# Altium schematic sheet 0056_DISPLAY - EDP MUX .SchDoc (part 2 of 2)
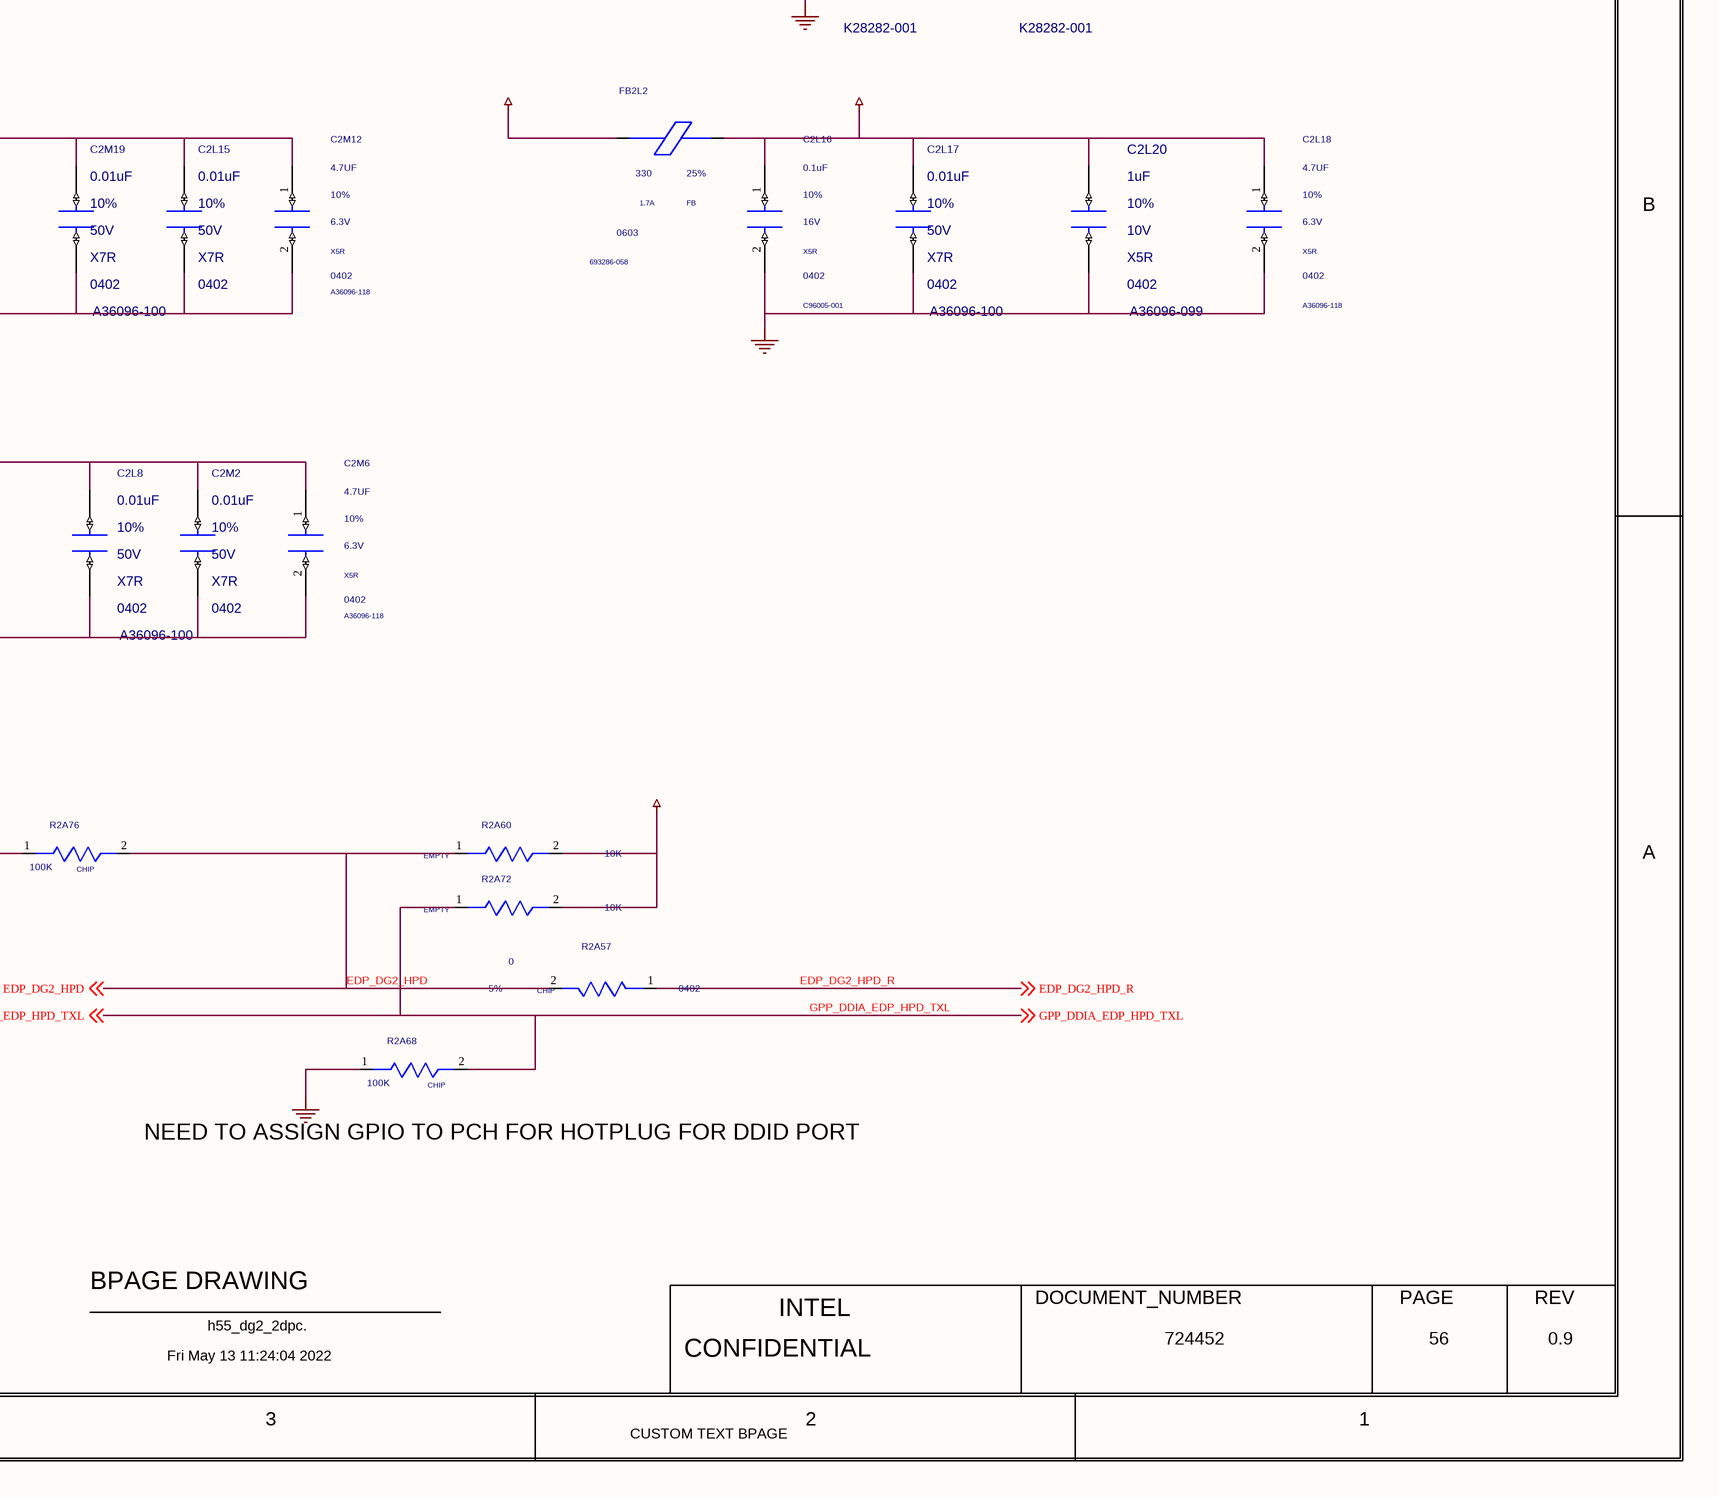
[diagram p6: 0056_DISPLAY - EDP MUX .SchDoc, bottom right]

## Library data of the parts
C2L7 = C_CAP: CDS_PHYS_PART_NAME: C_CAP_0402-K28282-001,X7R,0.1UF,16V,10%,TK2,GENERIC; CDS_LMAN_SYM_OUTLINE: -50,50,50,-50; FP_TECH: TK2; IP: GENERIC; ROOM: NONE; OriginalSymbolOrigin: (-50,25); XY: (-8450,3600); VER: 1; ROT: 0; PHYS_PAGE: 56; LOCATION: C2L7; DRAWING: @RVP1_ADL_SB_ADP_S_DDR5_SODIMM_2DPC_LIB.H55_DG2_2DPC(SCH_1):PAGE56; CDS_LIB: c_discrete; VARIANT: ?; PCB Footprint: CTK2_SM0402_1050X550_MA; CHIPS_PART_NAME: C_CAP; CDS_PART_NAME: C_CAP_0402-K28282-001,X7R,0.1UF,16V,10%,TK2,GENERIC; CDS_LOCATION: C2L7
C2L8 = C_CAP: CDS_PHYS_PART_NAME: C_CAP_0402-A36096-100,X7R,0.01UF,50V,10%,TK2,GENERIC; CDS_LMAN_SYM_OUTLINE: -50,50,50,-50; FP_TECH: TK2; IP: GENERIC; ROOM: NONE; OriginalSymbolOrigin: (-50,25); XY: (-7725,3600); VER: 1; ROT: 0; PHYS_PAGE: 56; LOCATION: C2L8; DRAWING: @RVP1_ADL_SB_ADP_S_DDR5_SODIMM_2DPC_LIB.H55_DG2_2DPC(SCH_1):PAGE56; CDS_LIB: c_discrete; VARIANT: ?; PCB Footprint: CTK2_SM0402_1050X550_MA; CHIPS_PART_NAME: C_CAP; CDS_PART_NAME: C_CAP_0402-A36096-100,X7R,0.01UF,50V,10%,TK2,GENERIC; CDS_LOCATION: C2L8
C2L9 = C_CAP: CDS_PHYS_PART_NAME: C_CAP_0402-K28282-001,X7R,0.1UF,16V,10%,TK2,GENERIC; CDS_LMAN_SYM_OUTLINE: -50,50,50,-50; FP_TECH: TK2; IP: GENERIC; ROOM: NONE; OriginalSymbolOrigin: (-50,25); XY: (-6400,4775); VER: 1; ROT: 0; PHYS_PAGE: 56; LOCATION: C2L9; DRAWING: @RVP1_ADL_SB_ADP_S_DDR5_SODIMM_2DPC_LIB.H55_DG2_2DPC(SCH_1):PAGE56; CDS_LIB: c_discrete; VARIANT: ?; PCB Footprint: CTK2_SM0402_1050X550_MA; CHIPS_PART_NAME: C_CAP; CDS_PART_NAME: C_CAP_0402-K28282-001,X7R,0.1UF,16V,10%,TK2,GENERIC; CDS_LOCATION: C2L9
C2L10 = C_CAP: CDS_PHYS_PART_NAME: C_CAP_0402-A36096-100,X7R,0.01UF,50V,10%,TK2,GENERIC; CDS_LMAN_SYM_OUTLINE: -50,50,50,-50; FP_TECH: TK2; IP: GENERIC; ROOM: NONE; OriginalSymbolOrigin: (-50,25); XY: (-7750,4800); VER: 1; ROT: 0; PHYS_PAGE: 56; LOCATION: C2L10; DRAWING: @RVP1_ADL_SB_ADP_S_DDR5_SODIMM_2DPC_LIB.H55_DG2_2DPC(SCH_1):PAGE56; CDS_LIB: c_discrete; VARIANT: ?; PCB Footprint: CTK2_SM0402_1050X550_MA; CHIPS_PART_NAME: C_CAP; CDS_PART_NAME: C_CAP_0402-A36096-100,X7R,0.01UF,50V,10%,TK2,GENERIC; CDS_LOCATION: C2L10
C2L11 = C_CAP: PART_NUMBER: K28282-001; CDS_PHYS_PART_NAME: C_CAP_0402-K28282-001,X7R,0.1UF,16V,10%,TK2,GENERIC; CDS_LMAN_SYM_OUTLINE: -50,50,50,-50; FP_TECH: TK2; IP: GENERIC; ROOM: NONE; OriginalSymbolOrigin: (-50,25); XY: (-8175,4800); VER: 1; ROT: 0; PHYS_PAGE: 56; LOCATION: C2L11; DRAWING: @RVP1_ADL_SB_ADP_S_DDR5_SODIMM_2DPC_LIB.H55_DG2_2DPC(SCH_1):PAGE56; CDS_LIB: c_discrete; VARIANT: ?; PCB Footprint: CTK2_SM0402_1050X550_MA; CHIPS_PART_NAME: C_CAP; CDS_PART_NAME: C_CAP_0402-K28282-001,X7R,0.1UF,16V,10%,TK2,GENERIC; CDS_LOCATION: C2L11
C2L12 = C_CAP: CDS_PHYS_PART_NAME: C_CAP_0402-A36096-100,X7R,0.01UF,50V,10%,TK2,GENERIC; CDS_LMAN_SYM_OUTLINE: -50,50,50,-50; FP_TECH: TK2; IP: GENERIC; ROOM: NONE; OriginalSymbolOrigin: (-50,25); XY: (-5750,4800); VER: 1; ROT: 0; PHYS_PAGE: 56; LOCATION: C2L12; DRAWING: @RVP1_ADL_SB_ADP_S_DDR5_SODIMM_2DPC_LIB.H55_DG2_2DPC(SCH_1):PAGE56; CDS_LIB: c_discrete; VARIANT: ?; PCB Footprint: CTK2_SM0402_1050X550_MA; CHIPS_PART_NAME: C_CAP; CDS_PART_NAME: C_CAP_0402-A36096-100,X7R,0.01UF,50V,10%,TK2,GENERIC; CDS_LOCATION: C2L12
C2L13 = CAP: CDS_PHYS_PART_NAME: CAP_0402-A36096-143,X5R,1UF,25V,10%,LPDB,GENERIC; OriginalSymbolOrigin: (-50,25); XY: (-6000,5400); VER: 1; ROT: 0; PHYS_PAGE: 56; LOCATION: C2L13; IP: GENERIC; FP_TECH: LPDB; DRAWING: @RVP1_ADL_SB_ADP_S_DDR5_SODIMM_2DPC_LIB.H55_DG2_2DPC(SCH_1):PAGE56; CDS_LIB: discrete; PCB Footprint: SMC0402MA; CHIPS_PART_NAME: CAP; CDS_PART_NAME: CAP_0402-A36096-143,X5R,1UF,25V,10%,LPDB,GENERIC; CDS_LOCATION: C2L13
C2L14 = C_CAP: CDS_PHYS_PART_NAME: C_CAP_0402-K28282-001,X7R,0.1UF,16V,10%,TK2,GENERIC; CDS_LMAN_SYM_OUTLINE: -50,50,50,-50; FP_TECH: TK2; IP: GENERIC; ROOM: NONE; OriginalSymbolOrigin: (-50,25); XY: (-8475,4200); VER: 1; ROT: 0; PHYS_PAGE: 56; LOCATION: C2L14; DRAWING: @RVP1_ADL_SB_ADP_S_DDR5_SODIMM_2DPC_LIB.H55_DG2_2DPC(SCH_1):PAGE56; CDS_LIB: c_discrete; VARIANT: ?; PCB Footprint: CTK2_SM0402_1050X550_MA; CHIPS_PART_NAME: C_CAP; CDS_PART_NAME: C_CAP_0402-K28282-001,X7R,0.1UF,16V,10%,TK2,GENERIC; CDS_LOCATION: C2L14
C2L15 = C_CAP: PART_NUMBER: A36096-100; CDS_PHYS_PART_NAME: C_CAP_0402-A36096-100,X7R,0.01UF,50V,10%,TK2,GENERIC; CDS_LMAN_SYM_OUTLINE: -50,50,50,-50; FP_TECH: TK2; IP: GENERIC; ROOM: NONE; OriginalSymbolOrigin: (-50,25); XY: (-7550,4200); VER: 1; ROT: 0; PHYS_PAGE: 56; LOCATION: C2L15; DRAWING: @RVP1_ADL_SB_ADP_S_DDR5_SODIMM_2DPC_LIB.H55_DG2_2DPC(SCH_1):PAGE56; CDS_LIB: c_discrete; VARIANT: ?; PCB Footprint: CTK2_SM0402_1050X550_MA; CHIPS_PART_NAME: C_CAP; CDS_PART_NAME: C_CAP_0402-A36096-100,X7R,0.01UF,50V,10%,TK2,GENERIC; CDS_LOCATION: C2L15
C2L16 = CAP: CDS_PHYS_PART_NAME: CAP_0402-C96005-001,X5R,0.1UF,16V,10%,LPDB,GENERIC; OriginalSymbolOrigin: (-50,25); XY: (-6475,4200); VER: 1; ROT: 0; PHYS_PAGE: 56; LOCATION: C2L16; IP: GENERIC; FP_TECH: LPDB; DRAWING: @RVP1_ADL_SB_ADP_S_DDR5_SODIMM_2DPC_LIB.H55_DG2_2DPC(SCH_1):PAGE56; CDS_LIB: discrete; PCB Footprint: SMC0402IE; CHIPS_PART_NAME: CAP; CDS_PART_NAME: CAP_0402-C96005-001,X5R,0.1UF,16V,10%,LPDB,GENERIC; CDS_LOCATION: C2L16
C2L17 = C_CAP: CDS_PHYS_PART_NAME: C_CAP_0402-A36096-100,X7R,0.01UF,50V,10%,TK2,GENERIC; CDS_LMAN_SYM_OUTLINE: -50,50,50,-50; FP_TECH: TK2; IP: GENERIC; ROOM: NONE; OriginalSymbolOrigin: (-50,25); XY: (-6200,4200); VER: 1; ROT: 0; PHYS_PAGE: 56; LOCATION: C2L17; DRAWING: @RVP1_ADL_SB_ADP_S_DDR5_SODIMM_2DPC_LIB.H55_DG2_2DPC(SCH_1):PAGE56; CDS_LIB: c_discrete; VARIANT: ?; PCB Footprint: CTK2_SM0402_1050X550_MA; CHIPS_PART_NAME: C_CAP; CDS_PART_NAME: C_CAP_0402-A36096-100,X7R,0.01UF,50V,10%,TK2,GENERIC; CDS_LOCATION: C2L17
C2L18 = CAP: CDS_PHYS_PART_NAME: CAP_0402-A36096-118,X5R,4.7UF,6.3V,10%,LPDB,GENERIC; OriginalSymbolOrigin: (-50,25); XY: (-5550,4200); VER: 1; ROT: 0; PHYS_PAGE: 56; LOCATION: C2L18; IP: GENERIC; FP_TECH: LPDB; DRAWING: @RVP1_ADL_SB_ADP_S_DDR5_SODIMM_2DPC_LIB.H55_DG2_2DPC(SCH_1):PAGE56; CDS_LIB: discrete; PCB Footprint: SMC0402MA; CHIPS_PART_NAME: CAP; CDS_PART_NAME: CAP_0402-A36096-118,X5R,4.7UF,6.3V,10%,LPDB,GENERIC; CDS_LOCATION: C2L18
C2L20 = C_CAP: CDS_PHYS_PART_NAME: C_CAP_0402-A36096-099,X5R,1UF,10V,10%,TK2,GENERIC; CDS_LMAN_SYM_OUTLINE: -50,50,50,-50; FP_TECH: TK2; IP: GENERIC; ROOM: NONE; OriginalSymbolOrigin: (-50,25); XY: (-5875,4200); VER: 1; ROT: 0; PHYS_PAGE: 56; LOCATION: C2L20; DRAWING: @RVP1_ADL_SB_ADP_S_DDR5_SODIMM_2DPC_LIB.H55_DG2_2DPC(SCH_1):PAGE56; CDS_LIB: c_discrete; VARIANT: ?; PCB Footprint: CTK2_SM0402_1050X550_MA; CHIPS_PART_NAME: C_CAP; CDS_PART_NAME: C_CAP_0402-A36096-099,X5R,1UF,10V,10%,TK2,GENERIC; CDS_LOCATION: C2L20
C2M1 = C_CAP: PART_NUMBER: A36096-100; CDS_PHYS_PART_NAME: C_CAP_0402-A36096-100,X7R,0.01UF,50V,10%,TK2,GENERIC; CDS_LMAN_SYM_OUTLINE: -50,50,50,-50; FP_TECH: TK2; IP: GENERIC; ROOM: NONE; OriginalSymbolOrigin: (-50,25); XY: (-5550,4800); VER: 1; ROT: 0; PHYS_PAGE: 56; LOCATION: C2M1; DRAWING: @RVP1_ADL_SB_ADP_S_DDR5_SODIMM_2DPC_LIB.H55_DG2_2DPC(SCH_1):PAGE56; CDS_LIB: c_discrete; VARIANT: ?; PCB Footprint: CTK2_SM0402_1050X550_MA; CHIPS_PART_NAME: C_CAP; CDS_PART_NAME: C_CAP_0402-A36096-100,X7R,0.01UF,50V,10%,TK2,GENERIC; CDS_LOCATION: C2M1
C2M2 = C_CAP: PART_NUMBER: A36096-100; CDS_PHYS_PART_NAME: C_CAP_0402-A36096-100,X7R,0.01UF,50V,10%,TK2,GENERIC; CDS_LMAN_SYM_OUTLINE: -50,50,50,-50; FP_TECH: TK2; IP: GENERIC; ROOM: NONE; OriginalSymbolOrigin: (-50,25); XY: (-7525,3600); VER: 1; ROT: 0; PHYS_PAGE: 56; LOCATION: C2M2; DRAWING: @RVP1_ADL_SB_ADP_S_DDR5_SODIMM_2DPC_LIB.H55_DG2_2DPC(SCH_1):PAGE56; CDS_LIB: c_discrete; VARIANT: ?; PCB Footprint: CTK2_SM0402_1050X550_MA; CHIPS_PART_NAME: C_CAP; CDS_PART_NAME: C_CAP_0402-A36096-100,X7R,0.01UF,50V,10%,TK2,GENERIC; CDS_LOCATION: C2M2
C2M4 = C_CAP: CDS_PHYS_PART_NAME: C_CAP_0402-K28282-001,X7R,0.1UF,16V,10%,TK2,GENERIC; CDS_LMAN_SYM_OUTLINE: -50,50,50,-50; FP_TECH: TK2; IP: GENERIC; ROOM: NONE; OriginalSymbolOrigin: (-50,25); XY: (-8475,4800); VER: 1; ROT: 0; PHYS_PAGE: 56; LOCATION: C2M4; DRAWING: @RVP1_ADL_SB_ADP_S_DDR5_SODIMM_2DPC_LIB.H55_DG2_2DPC(SCH_1):PAGE56; CDS_LIB: c_discrete; VARIANT: ?; PCB Footprint: CTK2_SM0402_1050X550_MA; CHIPS_PART_NAME: C_CAP; CDS_PART_NAME: C_CAP_0402-K28282-001,X7R,0.1UF,16V,10%,TK2,GENERIC; CDS_LOCATION: C2M4
C2M5 = CAP: CDS_PHYS_PART_NAME: CAP_0402-A36096-118,X5R,4.7UF,6.3V,10%,LPDB,GENERIC; OriginalSymbolOrigin: (-50,25); XY: (-5350,4800); VER: 1; ROT: 0; PHYS_PAGE: 56; LOCATION: C2M5; IP: GENERIC; FP_TECH: LPDB; DRAWING: @RVP1_ADL_SB_ADP_S_DDR5_SODIMM_2DPC_LIB.H55_DG2_2DPC(SCH_1):PAGE56; CDS_LIB: discrete; PCB Footprint: SMC0402MA; CHIPS_PART_NAME: CAP; CDS_PART_NAME: CAP_0402-A36096-118,X5R,4.7UF,6.3V,10%,LPDB,GENERIC; CDS_LOCATION: C2M5
C2M6 = CAP: CDS_PHYS_PART_NAME: CAP_0402-A36096-118,X5R,4.7UF,6.3V,10%,LPDB,GENERIC; OriginalSymbolOrigin: (-50,25); XY: (-7325,3600); VER: 1; ROT: 0; PHYS_PAGE: 56; LOCATION: C2M6; IP: GENERIC; FP_TECH: LPDB; DRAWING: @RVP1_ADL_SB_ADP_S_DDR5_SODIMM_2DPC_LIB.H55_DG2_2DPC(SCH_1):PAGE56; CDS_LIB: discrete; PCB Footprint: SMC0402MA; CHIPS_PART_NAME: CAP; CDS_PART_NAME: CAP_0402-A36096-118,X5R,4.7UF,6.3V,10%,LPDB,GENERIC; CDS_LOCATION: C2M6
C2M7 = C_CAP: CDS_PHYS_PART_NAME: C_CAP_0402-K28282-001,X7R,0.1UF,16V,10%,TK2,GENERIC; CDS_LMAN_SYM_OUTLINE: -50,50,50,-50; FP_TECH: TK2; IP: GENERIC; ROOM: NONE; OriginalSymbolOrigin: (-50,25); XY: (-6075,4775); VER: 1; ROT: 0; PHYS_PAGE: 56; LOCATION: C2M7; DRAWING: @RVP1_ADL_SB_ADP_S_DDR5_SODIMM_2DPC_LIB.H55_DG2_2DPC(SCH_1):PAGE56; CDS_LIB: c_discrete; VARIANT: ?; PCB Footprint: CTK2_SM0402_1050X550_MA; CHIPS_PART_NAME: C_CAP; CDS_PART_NAME: C_CAP_0402-K28282-001,X7R,0.1UF,16V,10%,TK2,GENERIC; CDS_LOCATION: C2M7
C2M8 = C_CAP: PART_NUMBER: A36096-100; CDS_PHYS_PART_NAME: C_CAP_0402-A36096-100,X7R,0.01UF,50V,10%,TK2,GENERIC; CDS_LMAN_SYM_OUTLINE: -50,50,50,-50; FP_TECH: TK2; IP: GENERIC; ROOM: NONE; OriginalSymbolOrigin: (-50,25); XY: (-7550,4800); VER: 1; ROT: 0; PHYS_PAGE: 56; LOCATION: C2M8; DRAWING: @RVP1_ADL_SB_ADP_S_DDR5_SODIMM_2DPC_LIB.H55_DG2_2DPC(SCH_1):PAGE56; CDS_LIB: c_discrete; VARIANT: ?; PCB Footprint: CTK2_SM0402_1050X550_MA; CHIPS_PART_NAME: C_CAP; CDS_PART_NAME: C_CAP_0402-A36096-100,X7R,0.01UF,50V,10%,TK2,GENERIC; CDS_LOCATION: C2M8
C2M11 = C_CAP: CDS_PHYS_PART_NAME: C_CAP_0402-K28282-001,X7R,0.1UF,16V,10%,TK2,GENERIC; CDS_LMAN_SYM_OUTLINE: -50,50,50,-50; FP_TECH: TK2; IP: GENERIC; ROOM: NONE; OriginalSymbolOrigin: (-50,25); XY: (-8125,3600); VER: 1; ROT: 0; PHYS_PAGE: 56; LOCATION: C2M11; DRAWING: @RVP1_ADL_SB_ADP_S_DDR5_SODIMM_2DPC_LIB.H55_DG2_2DPC(SCH_1):PAGE56; CDS_LIB: c_discrete; VARIANT: ?; PCB Footprint: CTK2_SM0402_1050X550_MA; CHIPS_PART_NAME: C_CAP; CDS_PART_NAME: C_CAP_0402-K28282-001,X7R,0.1UF,16V,10%,TK2,GENERIC; CDS_LOCATION: C2M11
C2M12 = CAP: CDS_PHYS_PART_NAME: CAP_0402-A36096-118,X5R,4.7UF,6.3V,10%,LPDB,GENERIC; OriginalSymbolOrigin: (-50,25); XY: (-7350,4200); VER: 1; ROT: 0; PHYS_PAGE: 56; LOCATION: C2M12; IP: GENERIC; FP_TECH: LPDB; DRAWING: @RVP1_ADL_SB_ADP_S_DDR5_SODIMM_2DPC_LIB.H55_DG2_2DPC(SCH_1):PAGE56; CDS_LIB: discrete; PCB Footprint: SMC0402MA; CHIPS_PART_NAME: CAP; CDS_PART_NAME: CAP_0402-A36096-118,X5R,4.7UF,6.3V,10%,LPDB,GENERIC; CDS_LOCATION: C2M12
C2M13 = CAP: CDS_PHYS_PART_NAME: CAP_0402-A36096-118,X5R,4.7UF,6.3V,10%,LPDB,GENERIC; OriginalSymbolOrigin: (-50,25); XY: (-7350,4800); VER: 1; ROT: 0; PHYS_PAGE: 56; LOCATION: C2M13; IP: GENERIC; FP_TECH: LPDB; DRAWING: @RVP1_ADL_SB_ADP_S_DDR5_SODIMM_2DPC_LIB.H55_DG2_2DPC(SCH_1):PAGE56; CDS_LIB: discrete; PCB Footprint: SMC0402MA; CHIPS_PART_NAME: CAP; CDS_PART_NAME: CAP_0402-A36096-118,X5R,4.7UF,6.3V,10%,LPDB,GENERIC; CDS_LOCATION: C2M13
C2M19 = C_CAP: CDS_PHYS_PART_NAME: C_CAP_0402-A36096-100,X7R,0.01UF,50V,10%,TK2,GENERIC; CDS_LMAN_SYM_OUTLINE: -50,50,50,-50; FP_TECH: TK2; IP: GENERIC; ROOM: NONE; OriginalSymbolOrigin: (-50,25); XY: (-7750,4200); VER: 1; ROT: 0; PHYS_PAGE: 56; LOCATION: C2M19; DRAWING: @RVP1_ADL_SB_ADP_S_DDR5_SODIMM_2DPC_LIB.H55_DG2_2DPC(SCH_1):PAGE56; CDS_LIB: c_discrete; VARIANT: ?; PCB Footprint: CTK2_SM0402_1050X550_MA; CHIPS_PART_NAME: C_CAP; CDS_PART_NAME: C_CAP_0402-A36096-100,X7R,0.01UF,50V,10%,TK2,GENERIC; CDS_LOCATION: C2M19
C2M20 = C_CAP: PART_NUMBER: K28282-001; CDS_PHYS_PART_NAME: C_CAP_0402-K28282-001,X7R,0.1UF,16V,10%,TK2,GENERIC; CDS_LMAN_SYM_OUTLINE: -50,50,50,-50; FP_TECH: TK2; IP: GENERIC; ROOM: NONE; OriginalSymbolOrigin: (-50,25); XY: (-8150,4200); VER: 1; ROT: 0; PHYS_PAGE: 56; LOCATION: C2M20; DRAWING: @RVP1_ADL_SB_ADP_S_DDR5_SODIMM_2DPC_LIB.H55_DG2_2DPC(SCH_1):PAGE56; CDS_LIB: c_discrete; VARIANT: ?; PCB Footprint: CTK2_SM0402_1050X550_MA; CHIPS_PART_NAME: C_CAP; CDS_PART_NAME: C_CAP_0402-K28282-001,X7R,0.1UF,16V,10%,TK2,GENERIC; CDS_LOCATION: C2M20
EU5601 = C_PS8461E_A: CDS_PHYS_PART_NAME: C_PS8461E_A_LCC-M58413-001,IC,PS8461EQFN66GTR-A3,TK2,GENERIC; CDS_LMAN_SYM_OUTLINE: -400,500,400,-550; FP_TECH: TK2; IP: GENERIC; PACK_TYPE: LCC; ROOM: NONE; OriginalSymbolOrigin: (-425,500); CaptureCellPackProp: C_PS8461E_AA; XY: (-11175,3700); VER: 1; ROT: 0; PHYS_PAGE: 56; LOCATION: EU5601; DRAWING: @RVP1_ADL_SB_ADP_S_DDR5_SODIMM_2DPC_LIB.H55_DG2_2DPC(SCH_1):PAGE56; CDS_LIB: local; VARIANT: ?; PCB Footprint: CTK2_LCC66_5000X10000_400_DF3600X8600_MA; SEC_TYPE: LCC; CHIPS_PART_NAME: C_PS8461E_A; CDS_PART_NAME: C_PS8461E_A_LCC-M58413-001,IC,PS8461EQFN66GTR-A3,TK2,GENERIC; CDS_LOCATION: EU5601
FB2L1 = C_FERRITE: CDS_PHYS_PART_NAME: C_FERRITE_0603-693286-058,FB,330,25%,1.7A,TK2,GENERIC; CDS_LMAN_SYM_OUTLINE: -50,50,50,-50; FP_TECH: TK2; IP: GENERIC; ROOM: NONE; OriginalSymbolOrigin: (-75,50); XY: (-8625,3750); VER: 1; ROT: 0; PHYS_PAGE: 56; LOCATION: FB2L1; DRAWING: @RVP1_ADL_SB_ADP_S_DDR5_SODIMM_2DPC_LIB.H55_DG2_2DPC(SCH_1):PAGE56; CDS_LIB: c_discrete; VARIANT: ?; PCB Footprint: CTK2_SM0603_1750X950_MA; CHIPS_PART_NAME: C_FERRITE; CDS_PART_NAME: C_FERRITE_0603-693286-058,FB,330,25%,1.7A,TK2,GENERIC; CDS_LOCATION: FB2L1
FB2L2 = C_FERRITE: CDS_PHYS_PART_NAME: C_FERRITE_0603-693286-058,FB,330,25%,1.7A,TK2,GENERIC; CDS_LMAN_SYM_OUTLINE: -50,50,50,-50; FP_TECH: TK2; IP: GENERIC; ROOM: NONE; OriginalSymbolOrigin: (-75,50); XY: (-6650,4350); VER: 1; ROT: 0; PHYS_PAGE: 56; LOCATION: FB2L2; DRAWING: @RVP1_ADL_SB_ADP_S_DDR5_SODIMM_2DPC_LIB.H55_DG2_2DPC(SCH_1):PAGE56; CDS_LIB: c_discrete; VARIANT: ?; PCB Footprint: CTK2_SM0603_1750X950_MA; CHIPS_PART_NAME: C_FERRITE; CDS_PART_NAME: C_FERRITE_0603-693286-058,FB,330,25%,1.7A,TK2,GENERIC; CDS_LOCATION: FB2L2
FB2L3 = C_FERRITE: CDS_PHYS_PART_NAME: C_FERRITE_0603-693286-058,FB,330,25%,1.7A,TK2,GENERIC; CDS_LMAN_SYM_OUTLINE: -50,50,50,-50; FP_TECH: TK2; IP: GENERIC; ROOM: NONE; OriginalSymbolOrigin: (-75,50); XY: (-6650,4950); VER: 1; ROT: 0; PHYS_PAGE: 56; LOCATION: FB2L3; DRAWING: @RVP1_ADL_SB_ADP_S_DDR5_SODIMM_2DPC_LIB.H55_DG2_2DPC(SCH_1):PAGE56; CDS_LIB: c_discrete; VARIANT: ?; PCB Footprint: CTK2_SM0603_1750X950_MA; CHIPS_PART_NAME: C_FERRITE; CDS_PART_NAME: C_FERRITE_0603-693286-058,FB,330,25%,1.7A,TK2,GENERIC; CDS_LOCATION: FB2L3
FB2M1 = C_FERRITE: CDS_PHYS_PART_NAME: C_FERRITE_0603-693286-058,FB,330,25%,1.7A,TK2,GENERIC; CDS_LMAN_SYM_OUTLINE: -50,50,50,-50; FP_TECH: TK2; IP: GENERIC; ROOM: NONE; OriginalSymbolOrigin: (-75,50); XY: (-8650,4350); VER: 1; ROT: 0; PHYS_PAGE: 56; LOCATION: FB2M1; DRAWING: @RVP1_ADL_SB_ADP_S_DDR5_SODIMM_2DPC_LIB.H55_DG2_2DPC(SCH_1):PAGE56; CDS_LIB: c_discrete; VARIANT: ?; PCB Footprint: CTK2_SM0603_1750X950_MA; CHIPS_PART_NAME: C_FERRITE; CDS_PART_NAME: C_FERRITE_0603-693286-058,FB,330,25%,1.7A,TK2,GENERIC; CDS_LOCATION: FB2M1
FB2M2 = C_FERRITE: CDS_PHYS_PART_NAME: C_FERRITE_0603-693286-058,FB,330,25%,1.7A,TK2,GENERIC; CDS_LMAN_SYM_OUTLINE: -50,50,50,-50; FP_TECH: TK2; IP: GENERIC; ROOM: NONE; OriginalSymbolOrigin: (-75,50); XY: (-8650,4950); VER: 1; ROT: 0; PHYS_PAGE: 56; LOCATION: FB2M2; DRAWING: @RVP1_ADL_SB_ADP_S_DDR5_SODIMM_2DPC_LIB.H55_DG2_2DPC(SCH_1):PAGE56; CDS_LIB: c_discrete; VARIANT: ?; PCB Footprint: CTK2_SM0603_1750X950_MA; CHIPS_PART_NAME: C_FERRITE; CDS_PART_NAME: C_FERRITE_0603-693286-058,FB,330,25%,1.7A,TK2,GENERIC; CDS_LOCATION: FB2M2
R2A33 = RES#1: PART_NUMBER: G21497-014; CHIPS_PART_NAME: RES; CDS_PHYS_PART_NAME: RES_0402-G21497-014,EMPTY,10K,5%,1/16W,LPDB,GENERIC; TOLERANCE: 5%; WATTAGE: 1/16W; OriginalSymbolOrigin: (-75,25); XY: (-11525,5700); VER: 1; ROOM: ROOM_PROP_TEST_73; PHYS_PAGE: 56; LOCATION: R2A33; IP: GENERIC; FP_TECH: LPDB; DRAWING: @RVP1_ADL_SB_ADP_S_DDR5_SODIMM_2DPC_LIB.H55_DG2_2DPC(SCH_1):PAGE56; CDS_LIB: discrete; PCB Footprint: SMR0402IA; ROT: 1; CDS_PART_NAME: RES_0402-G21497-014,EMPTY,10K,5%,1/16W,LPDB,GENERIC; CDS_LOCATION: R2A33
R2A34 = RES#1: PART_NUMBER: G21497-014; CHIPS_PART_NAME: RES; CDS_PHYS_PART_NAME: RES_0402-G21497-014,EMPTY,10K,5%,1/16W,LPDB,GENERIC; TOLERANCE: 5%; WATTAGE: 1/16W; OriginalSymbolOrigin: (-75,25); XY: (-10525,5700); VER: 1; ROOM: ROOM_PROP_TEST_73; PHYS_PAGE: 56; LOCATION: R2A34; IP: GENERIC; FP_TECH: LPDB; DRAWING: @RVP1_ADL_SB_ADP_S_DDR5_SODIMM_2DPC_LIB.H55_DG2_2DPC(SCH_1):PAGE56; CDS_LIB: discrete; PCB Footprint: SMR0402IA; ROT: 1; CDS_PART_NAME: RES_0402-G21497-014,EMPTY,10K,5%,1/16W,LPDB,GENERIC; CDS_LOCATION: R2A34
R2A35 = RES#1: PART_NUMBER: G21497-014; CHIPS_PART_NAME: RES; CDS_PHYS_PART_NAME: RES_0402-G21497-014,EMPTY,10K,5%,1/16W,LPDB,GENERIC; TOLERANCE: 5%; WATTAGE: 1/16W; OriginalSymbolOrigin: (-75,25); XY: (-11150,5700); VER: 1; ROOM: ROOM_PROP_TEST_73; PHYS_PAGE: 56; LOCATION: R2A35; IP: GENERIC; FP_TECH: LPDB; DRAWING: @RVP1_ADL_SB_ADP_S_DDR5_SODIMM_2DPC_LIB.H55_DG2_2DPC(SCH_1):PAGE56; CDS_LIB: discrete; PCB Footprint: SMR0402IA; ROT: 1; CDS_PART_NAME: RES_0402-G21497-014,EMPTY,10K,5%,1/16W,LPDB,GENERIC; CDS_LOCATION: R2A35
R2A36 = RES#1: PART_NUMBER: A93548-517; CHIPS_PART_NAME: RES; CDS_PHYS_PART_NAME: RES_0402-A93548-517,CHIP,4.7K,1%,1/16W,LPDB,GENERIC; TOLERANCE: 1%; WATTAGE: 1/16W; OriginalSymbolOrigin: (-75,25); XY: (-11400,5700); VER: 1; ROOM: ROOM_PROP_TEST_73; PHYS_PAGE: 56; LOCATION: R2A36; IP: GENERIC; FP_TECH: LPDB; DRAWING: @RVP1_ADL_SB_ADP_S_DDR5_SODIMM_2DPC_LIB.H55_DG2_2DPC(SCH_1):PAGE56; CDS_LIB: discrete; PCB Footprint: SMR0402IA; ROT: 1; CDS_PART_NAME: RES_0402-A93548-517,CHIP,4.7K,1%,1/16W,LPDB,GENERIC; CDS_LOCATION: R2A36
R2A37 = RES#1: PART_NUMBER: G21497-014; CHIPS_PART_NAME: RES; CDS_PHYS_PART_NAME: RES_0402-G21497-014,EMPTY,10K,5%,1/16W,LPDB,GENERIC; TOLERANCE: 5%; WATTAGE: 1/16W; OriginalSymbolOrigin: (-75,25); XY: (-11275,5700); VER: 1; ROOM: ROOM_PROP_TEST_73; PHYS_PAGE: 56; LOCATION: R2A37; IP: GENERIC; FP_TECH: LPDB; DRAWING: @RVP1_ADL_SB_ADP_S_DDR5_SODIMM_2DPC_LIB.H55_DG2_2DPC(SCH_1):PAGE56; CDS_LIB: discrete; PCB Footprint: SMR0402IA; ROT: 1; CDS_PART_NAME: RES_0402-G21497-014,EMPTY,10K,5%,1/16W,LPDB,GENERIC; CDS_LOCATION: R2A37
R2A38 = RES#1: PART_NUMBER: G21497-014; CHIPS_PART_NAME: RES; CDS_PHYS_PART_NAME: RES_0402-G21497-014,EMPTY,10K,5%,1/16W,LPDB,GENERIC; TOLERANCE: 5%; WATTAGE: 1/16W; OriginalSymbolOrigin: (-75,25); XY: (-5400,5350); VER: 1; ROOM: ROOM_PROP_TEST_73; PHYS_PAGE: 56; LOCATION: R2A38; IP: GENERIC; FP_TECH: LPDB; DRAWING: @RVP1_ADL_SB_ADP_S_DDR5_SODIMM_2DPC_LIB.H55_DG2_2DPC(SCH_1):PAGE56; CDS_LIB: discrete; PCB Footprint: SMR0402IA; ROT: 1; CDS_PART_NAME: RES_0402-G21497-014,EMPTY,10K,5%,1/16W,LPDB,GENERIC; CDS_LOCATION: R2A38
R2A40 = RES#1: PART_NUMBER: A93548-517; CHIPS_PART_NAME: RES; CDS_PHYS_PART_NAME: RES_0402-A93548-517,CHIP,4.7K,1%,1/16W,LPDB,GENERIC; TOLERANCE: 1%; WATTAGE: 1/16W; OriginalSymbolOrigin: (-75,25); XY: (-11525,6450); VER: 1; ROOM: ROOM_PROP_TEST_73; PHYS_PAGE: 56; LOCATION: R2A40; IP: GENERIC; FP_TECH: LPDB; DRAWING: @RVP1_ADL_SB_ADP_S_DDR5_SODIMM_2DPC_LIB.H55_DG2_2DPC(SCH_1):PAGE56; CDS_LIB: discrete; PCB Footprint: SMR0402IA; ROT: 1; CDS_PART_NAME: RES_0402-A93548-517,CHIP,4.7K,1%,1/16W,LPDB,GENERIC; CDS_LOCATION: R2A40
R2A41 = RES#1: PART_NUMBER: G21497-014; CHIPS_PART_NAME: RES; CDS_PHYS_PART_NAME: RES_0402-G21497-014,EMPTY,10K,5%,1/16W,LPDB,GENERIC; TOLERANCE: 5%; WATTAGE: 1/16W; OriginalSymbolOrigin: (-75,25); XY: (-10525,6450); VER: 1; ROOM: ROOM_PROP_TEST_73; PHYS_PAGE: 56; LOCATION: R2A41; IP: GENERIC; FP_TECH: LPDB; DRAWING: @RVP1_ADL_SB_ADP_S_DDR5_SODIMM_2DPC_LIB.H55_DG2_2DPC(SCH_1):PAGE56; CDS_LIB: discrete; PCB Footprint: SMR0402IA; ROT: 1; CDS_PART_NAME: RES_0402-G21497-014,EMPTY,10K,5%,1/16W,LPDB,GENERIC; CDS_LOCATION: R2A41
R2A42 = RES#1: PART_NUMBER: A93548-517; CHIPS_PART_NAME: RES; CDS_PHYS_PART_NAME: RES_0402-A93548-517,CHIP,4.7K,1%,1/16W,LPDB,GENERIC; TOLERANCE: 1%; WATTAGE: 1/16W; OriginalSymbolOrigin: (-75,25); XY: (-11150,6450); VER: 1; ROOM: ROOM_PROP_TEST_73; PHYS_PAGE: 56; LOCATION: R2A42; IP: GENERIC; FP_TECH: LPDB; DRAWING: @RVP1_ADL_SB_ADP_S_DDR5_SODIMM_2DPC_LIB.H55_DG2_2DPC(SCH_1):PAGE56; CDS_LIB: discrete; PCB Footprint: SMR0402IA; ROT: 1; CDS_PART_NAME: RES_0402-A93548-517,CHIP,4.7K,1%,1/16W,LPDB,GENERIC; CDS_LOCATION: R2A42
R2A43 = RES#1: PART_NUMBER: G21497-014; CHIPS_PART_NAME: RES; CDS_PHYS_PART_NAME: RES_0402-G21497-014,EMPTY,10K,5%,1/16W,LPDB,GENERIC; TOLERANCE: 5%; WATTAGE: 1/16W; OriginalSymbolOrigin: (-75,25); XY: (-11400,6450); VER: 1; ROOM: ROOM_PROP_TEST_73; PHYS_PAGE: 56; LOCATION: R2A43; IP: GENERIC; FP_TECH: LPDB; DRAWING: @RVP1_ADL_SB_ADP_S_DDR5_SODIMM_2DPC_LIB.H55_DG2_2DPC(SCH_1):PAGE56; CDS_LIB: discrete; PCB Footprint: SMR0402IA; ROT: 1; CDS_PART_NAME: RES_0402-G21497-014,EMPTY,10K,5%,1/16W,LPDB,GENERIC; CDS_LOCATION: R2A43
R2A44 = RES#1: PART_NUMBER: A93548-517; CHIPS_PART_NAME: RES; CDS_PHYS_PART_NAME: RES_0402-A93548-517,CHIP,4.7K,1%,1/16W,LPDB,GENERIC; TOLERANCE: 1%; WATTAGE: 1/16W; OriginalSymbolOrigin: (-75,25); XY: (-11275,6450); VER: 1; ROOM: ROOM_PROP_TEST_73; PHYS_PAGE: 56; LOCATION: R2A44; IP: GENERIC; FP_TECH: LPDB; DRAWING: @RVP1_ADL_SB_ADP_S_DDR5_SODIMM_2DPC_LIB.H55_DG2_2DPC(SCH_1):PAGE56; CDS_LIB: discrete; PCB Footprint: SMR0402IA; ROT: 1; CDS_PART_NAME: RES_0402-A93548-517,CHIP,4.7K,1%,1/16W,LPDB,GENERIC; CDS_LOCATION: R2A44
R2A46 = RES#1: PART_NUMBER: G21497-014; CHIPS_PART_NAME: RES; CDS_PHYS_PART_NAME: RES_0402-G21497-014,EMPTY,10K,5%,1/16W,LPDB,GENERIC; TOLERANCE: 5%; WATTAGE: 1/16W; OriginalSymbolOrigin: (-75,25); XY: (-5400,6400); VER: 1; ROOM: ROOM_PROP_TEST_73; PHYS_PAGE: 56; LOCATION: R2A46; IP: GENERIC; FP_TECH: LPDB; DRAWING: @RVP1_ADL_SB_ADP_S_DDR5_SODIMM_2DPC_LIB.H55_DG2_2DPC(SCH_1):PAGE56; CDS_LIB: discrete; PCB Footprint: SMR0402IA; ROT: 1; CDS_PART_NAME: RES_0402-G21497-014,EMPTY,10K,5%,1/16W,LPDB,GENERIC; CDS_LOCATION: R2A46
R2A47 = RES: CDS_PHYS_PART_NAME: RES_0402-A93548-202,CHIP,4.99K,1%,1/16W,LPDB,GENERIC; WATTAGE: 1/16W; OriginalSymbolOrigin: (-25,75); XY: (-5700,5350); VER: 2; ROT: 0; PHYS_PAGE: 56; LOCATION: R2A47; IP: GENERIC; FP_TECH: LPDB; DRAWING: @RVP1_ADL_SB_ADP_S_DDR5_SODIMM_2DPC_LIB.H55_DG2_2DPC(SCH_1):PAGE56; CDS_LIB: discrete; PCB Footprint: SMR0402IA; CHIPS_PART_NAME: RES; CDS_PART_NAME: RES_0402-A93548-202,CHIP,4.99K,1%,1/16W,LPDB,GENERIC; CDS_LOCATION: R2A47
R2A49 = RES#1: PART_NUMBER: A93549-001; CHIPS_PART_NAME: RES; CDS_PHYS_PART_NAME: RES_0402-A93549-001,CHIP,0,5%,1/16W,LPDB,GENERIC; WATTAGE: 1/16W; OriginalSymbolOrigin: (-75,25); XY: (-9400,2300); VER: 1; ROT: 2; PHYS_PAGE: 56; LOCATION: R2A49; IP: GENERIC; FP_TECH: LPDB; DRAWING: @RVP1_ADL_SB_ADP_S_DDR5_SODIMM_2DPC_LIB.H55_DG2_2DPC(SCH_1):PAGE56; CDS_LIB: discrete; PCB Footprint: SMR0402IA; CDS_PART_NAME: RES_0402-A93549-001,CHIP,0,5%,1/16W,LPDB,GENERIC; CDS_LOCATION: R2A49
R2A52 = RES#1: PART_NUMBER: A93549-001; CHIPS_PART_NAME: RES; CDS_PHYS_PART_NAME: RES_0402-A93549-001,CHIP,0,5%,1/16W,LPDB,GENERIC; WATTAGE: 1/16W; OriginalSymbolOrigin: (-75,25); XY: (-9400,2400); VER: 1; ROT: 2; PHYS_PAGE: 56; LOCATION: R2A52; IP: GENERIC; FP_TECH: LPDB; DRAWING: @RVP1_ADL_SB_ADP_S_DDR5_SODIMM_2DPC_LIB.H55_DG2_2DPC(SCH_1):PAGE56; CDS_LIB: discrete; PCB Footprint: SMR0402IA; CDS_PART_NAME: RES_0402-A93549-001,CHIP,0,5%,1/16W,LPDB,GENERIC; CDS_LOCATION: R2A52
R2A55 = RES#1: PART_NUMBER: G21497-014; CHIPS_PART_NAME: RES; CDS_PHYS_PART_NAME: RES_0402-G21497-014,EMPTY,10K,5%,1/16W,LPDB,GENERIC; TOLERANCE: 5%; WATTAGE: 1/16W; OriginalSymbolOrigin: (-75,25); XY: (-10900,6450); VER: 1; ROOM: ROOM_PROP_TEST_73; PHYS_PAGE: 56; LOCATION: R2A55; IP: GENERIC; FP_TECH: LPDB; DRAWING: @RVP1_ADL_SB_ADP_S_DDR5_SODIMM_2DPC_LIB.H55_DG2_2DPC(SCH_1):PAGE56; CDS_LIB: discrete; PCB Footprint: SMR0402IA; ROT: 1; CDS_PART_NAME: RES_0402-G21497-014,EMPTY,10K,5%,1/16W,LPDB,GENERIC; CDS_LOCATION: R2A55
R2A56 = RES#1: PART_NUMBER: G21497-014; CHIPS_PART_NAME: RES; CDS_PHYS_PART_NAME: RES_0402-G21497-014,EMPTY,10K,5%,1/16W,LPDB,GENERIC; TOLERANCE: 5%; WATTAGE: 1/16W; OriginalSymbolOrigin: (-75,25); XY: (-10900,5700); VER: 1; ROOM: ROOM_PROP_TEST_73; PHYS_PAGE: 56; LOCATION: R2A56; IP: GENERIC; FP_TECH: LPDB; DRAWING: @RVP1_ADL_SB_ADP_S_DDR5_SODIMM_2DPC_LIB.H55_DG2_2DPC(SCH_1):PAGE56; CDS_LIB: discrete; PCB Footprint: SMR0402IA; ROT: 1; CDS_PART_NAME: RES_0402-G21497-014,EMPTY,10K,5%,1/16W,LPDB,GENERIC; CDS_LOCATION: R2A56
R2A57 = RES#1: PART_NUMBER: A93549-001; CHIPS_PART_NAME: RES; CDS_PHYS_PART_NAME: RES_0402-A93549-001,CHIP,0,5%,1/16W,LPDB,GENERIC; WATTAGE: 1/16W; OriginalSymbolOrigin: (-75,25); XY: (-6775,2775); VER: 1; ROT: 2; PHYS_PAGE: 56; LOCATION: R2A57; IP: GENERIC; FP_TECH: LPDB; DRAWING: @RVP1_ADL_SB_ADP_S_DDR5_SODIMM_2DPC_LIB.H55_DG2_2DPC(SCH_1):PAGE56; CDS_LIB: discrete; PCB Footprint: SMR0402IA; CDS_PART_NAME: RES_0402-A93549-001,CHIP,0,5%,1/16W,LPDB,GENERIC; CDS_LOCATION: R2A57
R2A58 = RES#1: PART_NUMBER: G21497-014; CHIPS_PART_NAME: RES; CDS_PHYS_PART_NAME: RES_0402-G21497-014,EMPTY,10K,5%,1/16W,LPDB,GENERIC; TOLERANCE: 5%; WATTAGE: 1/16W; OriginalSymbolOrigin: (-75,25); XY: (-11025,6450); VER: 1; ROOM: ROOM_PROP_TEST_73; PHYS_PAGE: 56; LOCATION: R2A58; IP: GENERIC; FP_TECH: LPDB; DRAWING: @RVP1_ADL_SB_ADP_S_DDR5_SODIMM_2DPC_LIB.H55_DG2_2DPC(SCH_1):PAGE56; CDS_LIB: discrete; PCB Footprint: SMR0402IA; ROT: 1; CDS_PART_NAME: RES_0402-G21497-014,EMPTY,10K,5%,1/16W,LPDB,GENERIC; CDS_LOCATION: R2A58
R2A59 = RES#1: PART_NUMBER: G21497-014; CHIPS_PART_NAME: RES; CDS_PHYS_PART_NAME: RES_0402-G21497-014,EMPTY,10K,5%,1/16W,LPDB,GENERIC; TOLERANCE: 5%; WATTAGE: 1/16W; OriginalSymbolOrigin: (-75,25); XY: (-11025,5700); VER: 1; ROOM: ROOM_PROP_TEST_73; PHYS_PAGE: 56; LOCATION: R2A59; IP: GENERIC; FP_TECH: LPDB; DRAWING: @RVP1_ADL_SB_ADP_S_DDR5_SODIMM_2DPC_LIB.H55_DG2_2DPC(SCH_1):PAGE56; CDS_LIB: discrete; PCB Footprint: SMR0402IA; ROT: 1; CDS_PART_NAME: RES_0402-G21497-014,EMPTY,10K,5%,1/16W,LPDB,GENERIC; CDS_LOCATION: R2A59
R2A60 = RES#1: PART_NUMBER: G21497-014; CHIPS_PART_NAME: RES; CDS_PHYS_PART_NAME: RES_0402-G21497-014,EMPTY,10K,5%,1/16W,LPDB,GENERIC; PACK_TYPE: 0402; TOLERANCE: 5%; WATTAGE: 1/16W; OriginalSymbolOrigin: (-75,25); XY: (-6950,3025); VER: 1; ROT: 0; ROOM: ROOM_PROP_TEST_73; PHYS_PAGE: 56; LOCATION: R2A60; IP: GENERIC; FP_TECH: LPDB; DRAWING: @RVP1_ADL_SB_ADP_S_DDR5_SODIMM_2DPC_LIB.H55_DG2_2DPC(SCH_1):PAGE56; CDS_LIB: discrete; PCB Footprint: SMR0402IA; CDS_PART_NAME: RES_0402-G21497-014,EMPTY,10K,5%,1/16W,LPDB,GENERIC; CDS_LOCATION: R2A60
R2A61 = RES#1: PART_NUMBER: G21497-014; CHIPS_PART_NAME: RES; CDS_PHYS_PART_NAME: RES_0402-G21497-014,EMPTY,10K,5%,1/16W,LPDB,GENERIC; TOLERANCE: 5%; WATTAGE: 1/16W; OriginalSymbolOrigin: (-75,25); XY: (-10650,6450); VER: 1; ROOM: ROOM_PROP_TEST_73; PHYS_PAGE: 56; LOCATION: R2A61; IP: GENERIC; FP_TECH: LPDB; DRAWING: @RVP1_ADL_SB_ADP_S_DDR5_SODIMM_2DPC_LIB.H55_DG2_2DPC(SCH_1):PAGE56; CDS_LIB: discrete; PCB Footprint: SMR0402IA; ROT: 1; CDS_PART_NAME: RES_0402-G21497-014,EMPTY,10K,5%,1/16W,LPDB,GENERIC; CDS_LOCATION: R2A61
R2A62 = RES#1: PART_NUMBER: G21497-014; CHIPS_PART_NAME: RES; CDS_PHYS_PART_NAME: RES_0402-G21497-014,EMPTY,10K,5%,1/16W,LPDB,GENERIC; TOLERANCE: 5%; WATTAGE: 1/16W; OriginalSymbolOrigin: (-75,25); XY: (-10650,5700); VER: 1; ROOM: ROOM_PROP_TEST_73; PHYS_PAGE: 56; LOCATION: R2A62; IP: GENERIC; FP_TECH: LPDB; DRAWING: @RVP1_ADL_SB_ADP_S_DDR5_SODIMM_2DPC_LIB.H55_DG2_2DPC(SCH_1):PAGE56; CDS_LIB: discrete; PCB Footprint: SMR0402IA; ROT: 1; CDS_PART_NAME: RES_0402-G21497-014,EMPTY,10K,5%,1/16W,LPDB,GENERIC; CDS_LOCATION: R2A62
R2A64 = RES#1: PART_NUMBER: G21497-014; CHIPS_PART_NAME: RES; CDS_PHYS_PART_NAME: RES_0402-G21497-014,EMPTY,10K,5%,1/16W,LPDB,GENERIC; TOLERANCE: 5%; WATTAGE: 1/16W; OriginalSymbolOrigin: (-75,25); XY: (-10775,6450); VER: 1; ROOM: ROOM_PROP_TEST_73; PHYS_PAGE: 56; LOCATION: R2A64; IP: GENERIC; FP_TECH: LPDB; DRAWING: @RVP1_ADL_SB_ADP_S_DDR5_SODIMM_2DPC_LIB.H55_DG2_2DPC(SCH_1):PAGE56; CDS_LIB: discrete; PCB Footprint: SMR0402IA; ROT: 1; CDS_PART_NAME: RES_0402-G21497-014,EMPTY,10K,5%,1/16W,LPDB,GENERIC; CDS_LOCATION: R2A64
R2A65 = RES#1: PART_NUMBER: G21497-014; CHIPS_PART_NAME: RES; CDS_PHYS_PART_NAME: RES_0402-G21497-014,EMPTY,10K,5%,1/16W,LPDB,GENERIC; TOLERANCE: 5%; WATTAGE: 1/16W; OriginalSymbolOrigin: (-75,25); XY: (-10775,5700); VER: 1; ROOM: ROOM_PROP_TEST_73; PHYS_PAGE: 56; LOCATION: R2A65; IP: GENERIC; FP_TECH: LPDB; DRAWING: @RVP1_ADL_SB_ADP_S_DDR5_SODIMM_2DPC_LIB.H55_DG2_2DPC(SCH_1):PAGE56; CDS_LIB: discrete; PCB Footprint: SMR0402IA; ROT: 1; CDS_PART_NAME: RES_0402-G21497-014,EMPTY,10K,5%,1/16W,LPDB,GENERIC; CDS_LOCATION: R2A65
R2A68 = RES#1: PART_NUMBER: A93549-027; CHIPS_PART_NAME: RES; CDS_PHYS_PART_NAME: RES_0402-A93549-027,CHIP,100K,5%,1/16W,LPDB,GENERIC; PACK_TYPE: 0402; TOLERANCE: 5%; WATTAGE: 1/16W; OriginalSymbolOrigin: (-75,25); XY: (-7125,2625); VER: 1; ROT: 0; PHYS_PAGE: 56; LOCATION: R2A68; IP: GENERIC; FP_TECH: LPDB; DRAWING: @RVP1_ADL_SB_ADP_S_DDR5_SODIMM_2DPC_LIB.H55_DG2_2DPC(SCH_1):PAGE56; CDS_LIB: discrete; PCB Footprint: SMR0402IA; CDS_PART_NAME: RES_0402-A93549-027,CHIP,100K,5%,1/16W,LPDB,GENERIC; CDS_LOCATION: R2A68
R2A69 = RES#1: PART_NUMBER: A93548-517; CHIPS_PART_NAME: RES; CDS_PHYS_PART_NAME: RES_0402-A93548-517,CHIP,4.7K,1%,1/16W,LPDB,GENERIC; TOLERANCE: 1%; WATTAGE: 1/16W; OriginalSymbolOrigin: (-75,25); XY: (-11650,6450); VER: 1; ROOM: ROOM_PROP_TEST_73; PHYS_PAGE: 56; LOCATION: R2A69; IP: GENERIC; FP_TECH: LPDB; DRAWING: @RVP1_ADL_SB_ADP_S_DDR5_SODIMM_2DPC_LIB.H55_DG2_2DPC(SCH_1):PAGE56; CDS_LIB: discrete; PCB Footprint: SMR0402IA; ROT: 1; CDS_PART_NAME: RES_0402-A93548-517,CHIP,4.7K,1%,1/16W,LPDB,GENERIC; CDS_LOCATION: R2A69
R2A70 = RES#1: PART_NUMBER: G21497-014; CHIPS_PART_NAME: RES; CDS_PHYS_PART_NAME: RES_0402-G21497-014,EMPTY,10K,5%,1/16W,LPDB,GENERIC; TOLERANCE: 5%; WATTAGE: 1/16W; OriginalSymbolOrigin: (-75,25); XY: (-11650,5700); VER: 1; ROOM: ROOM_PROP_TEST_73; PHYS_PAGE: 56; LOCATION: R2A70; IP: GENERIC; FP_TECH: LPDB; DRAWING: @RVP1_ADL_SB_ADP_S_DDR5_SODIMM_2DPC_LIB.H55_DG2_2DPC(SCH_1):PAGE56; CDS_LIB: discrete; PCB Footprint: SMR0402IA; ROT: 1; CDS_PART_NAME: RES_0402-G21497-014,EMPTY,10K,5%,1/16W,LPDB,GENERIC; CDS_LOCATION: R2A70
R2A72 = RES#1: PART_NUMBER: G21497-014; CHIPS_PART_NAME: RES; CDS_PHYS_PART_NAME: RES_0402-G21497-014,EMPTY,10K,5%,1/16W,LPDB,GENERIC; PACK_TYPE: 0402; TOLERANCE: 5%; WATTAGE: 1/16W; OriginalSymbolOrigin: (-75,25); XY: (-6950,2925); VER: 1; ROT: 0; ROOM: ROOM_PROP_TEST_73; PHYS_PAGE: 56; LOCATION: R2A72; IP: GENERIC; FP_TECH: LPDB; DRAWING: @RVP1_ADL_SB_ADP_S_DDR5_SODIMM_2DPC_LIB.H55_DG2_2DPC(SCH_1):PAGE56; CDS_LIB: discrete; PCB Footprint: SMR0402IA; CDS_PART_NAME: RES_0402-G21497-014,EMPTY,10K,5%,1/16W,LPDB,GENERIC; CDS_LOCATION: R2A72
R2A73 = C_RES: PART_NUMBER: A93548-128; CDS_PHYS_PART_NAME: C_RES_0402-A93548-128,EMPTY,100K,1%,0.0625W,TK2,GENERIC; CDS_LMAN_SYM_OUTLINE: -50,50,50,-50; FP_TECH: TK2; IP: GENERIC; ROOM: NONE; WATTAGE: 0.0625W; OriginalSymbolOrigin: (-25,75); XY: (-10150,3275); VER: 2; ROT: 0; PHYS_PAGE: 56; LOCATION: R2A73; DRAWING: @RVP1_ADL_SB_ADP_S_DDR5_SODIMM_2DPC_LIB.H55_DG2_2DPC(SCH_1):PAGE56; CDS_LIB: c_discrete; VARIANT: ?; PCB Footprint: CTK2_SM0402_1100X550_MA; CHIPS_PART_NAME: C_RES; CDS_PART_NAME: C_RES_0402-A93548-128,EMPTY,100K,1%,0.0625W,TK2,GENERIC; CDS_LOCATION: R2A73
R2A76 = RES#1: PART_NUMBER: A93549-027; CHIPS_PART_NAME: RES; CDS_PHYS_PART_NAME: RES_0402-A93549-027,CHIP,100K,5%,1/16W,LPDB,GENERIC; PACK_TYPE: 0402; TOLERANCE: 5%; WATTAGE: 1/16W; OriginalSymbolOrigin: (-75,25); XY: (-7750,3025); VER: 1; ROT: 0; PHYS_PAGE: 56; LOCATION: R2A76; IP: GENERIC; FP_TECH: LPDB; DRAWING: @RVP1_ADL_SB_ADP_S_DDR5_SODIMM_2DPC_LIB.H55_DG2_2DPC(SCH_1):PAGE56; CDS_LIB: discrete; PCB Footprint: SMR0402IA; CDS_PART_NAME: RES_0402-A93549-027,CHIP,100K,5%,1/16W,LPDB,GENERIC; CDS_LOCATION: R2A76
R2B2 = C_RES: CDS_PHYS_PART_NAME: C_RES_0402-A93549-028,RES,1M,5%,0.0625W,TK2,GENERIC; CDS_LMAN_SYM_OUTLINE: -50,50,50,-50; FP_TECH: TK2; IP: GENERIC; ROOM: NONE; OriginalSymbolOrigin: (-25,75); XY: (-9825,3275); VER: 2; ROT: 0; PHYS_PAGE: 56; LOCATION: R2B2; DRAWING: @RVP1_ADL_SB_ADP_S_DDR5_SODIMM_2DPC_LIB.H55_DG2_2DPC(SCH_1):PAGE56; CDS_LIB: c_discrete; VARIANT: ?; PCB Footprint: CTK2_SM0402_1100X550_MA; CHIPS_PART_NAME: C_RES; CDS_PART_NAME: C_RES_0402-A93549-028,RES,1M,5%,0.0625W,TK2,GENERIC; CDS_LOCATION: R2B2
R2B26 = RES#1: PART_NUMBER: H11075-001; CHIPS_PART_NAME: RES; CDS_PHYS_PART_NAME: RES_0201-H11075-001,EMPTY,1M,1%,1/20W,LPDB,GENERIC; PACK_TYPE: 0201; TOLERANCE: 1%; WATTAGE: 1/20W; OriginalSymbolOrigin: (-75,25); XY: (-10975,5125); VER: 1; ROT: 0; PHYS_PAGE: 56; LOCATION: R2B26; IP: GENERIC; FP_TECH: LPDB; DRAWING: @RVP1_ADL_SB_ADP_S_DDR5_SODIMM_2DPC_LIB.H55_DG2_2DPC(SCH_1):PAGE56; CDS_LIB: discrete; PCB Footprint: SMR0201IA; CDS_PART_NAME: RES_0201-H11075-001,EMPTY,1M,1%,1/20W,LPDB,GENERIC; CDS_LOCATION: R2B26
R2B27 = RES#1: PART_NUMBER: H11075-001; CHIPS_PART_NAME: RES; CDS_PHYS_PART_NAME: RES_0201-H11075-001,EMPTY,1M,1%,1/20W,LPDB,GENERIC; PACK_TYPE: 0201; TOLERANCE: 1%; WATTAGE: 1/20W; OriginalSymbolOrigin: (-75,25); XY: (-10975,5200); VER: 1; ROT: 0; PHYS_PAGE: 56; LOCATION: R2B27; IP: GENERIC; FP_TECH: LPDB; DRAWING: @RVP1_ADL_SB_ADP_S_DDR5_SODIMM_2DPC_LIB.H55_DG2_2DPC(SCH_1):PAGE56; CDS_LIB: discrete; PCB Footprint: SMR0201IA; CDS_PART_NAME: RES_0201-H11075-001,EMPTY,1M,1%,1/20W,LPDB,GENERIC; CDS_LOCATION: R2B27
R2B28 = RES#1: PART_NUMBER: H11075-001; CHIPS_PART_NAME: RES; CDS_PHYS_PART_NAME: RES_0201-H11075-001,EMPTY,1M,1%,1/20W,LPDB,GENERIC; PACK_TYPE: 0201; TOLERANCE: 1%; WATTAGE: 1/20W; OriginalSymbolOrigin: (-75,25); XY: (-10975,4975); VER: 1; ROT: 0; PHYS_PAGE: 56; LOCATION: R2B28; IP: GENERIC; FP_TECH: LPDB; DRAWING: @RVP1_ADL_SB_ADP_S_DDR5_SODIMM_2DPC_LIB.H55_DG2_2DPC(SCH_1):PAGE56; CDS_LIB: discrete; PCB Footprint: SMR0201IA; CDS_PART_NAME: RES_0201-H11075-001,EMPTY,1M,1%,1/20W,LPDB,GENERIC; CDS_LOCATION: R2B28
R2B29 = RES#1: PART_NUMBER: H11075-001; CHIPS_PART_NAME: RES; CDS_PHYS_PART_NAME: RES_0201-H11075-001,EMPTY,1M,1%,1/20W,LPDB,GENERIC; PACK_TYPE: 0201; TOLERANCE: 1%; WATTAGE: 1/20W; OriginalSymbolOrigin: (-75,25); XY: (-10975,5050); VER: 1; ROT: 0; PHYS_PAGE: 56; LOCATION: R2B29; IP: GENERIC; FP_TECH: LPDB; DRAWING: @RVP1_ADL_SB_ADP_S_DDR5_SODIMM_2DPC_LIB.H55_DG2_2DPC(SCH_1):PAGE56; CDS_LIB: discrete; PCB Footprint: SMR0201IA; CDS_PART_NAME: RES_0201-H11075-001,EMPTY,1M,1%,1/20W,LPDB,GENERIC; CDS_LOCATION: R2B29
R2L8 = RES: PART_NUMBER: A93548-034; CDS_PHYS_PART_NAME: RES_0402-A93548-034,EMPTY,10K,1%,1/16W,LPDB,GENERIC; WATTAGE: 1/16W; OriginalSymbolOrigin: (-25,75); XY: (-9050,2575); VER: 2; PHYS_PAGE: 56; LOCATION: R2L8; IP: GENERIC; FP_TECH: LPDB; DRAWING: @RVP1_ADL_SB_ADP_S_DDR5_SODIMM_2DPC_LIB.H55_DG2_2DPC(SCH_1):PAGE56; CDS_LIB: discrete; PCB Footprint: SMR0402IA; ROT: 2; CHIPS_PART_NAME: RES; CDS_PART_NAME: RES_0402-A93548-034,EMPTY,10K,1%,1/16W,LPDB,GENERIC; CDS_LOCATION: R2L8; ASI_MODEL: A93548-034
R2L9 = RES: PART_NUMBER: A93548-034; CDS_PHYS_PART_NAME: RES_0402-A93548-034,EMPTY,10K,1%,1/16W,LPDB,GENERIC; WATTAGE: 1/16W; OriginalSymbolOrigin: (-25,75); XY: (-9250,2575); VER: 2; PHYS_PAGE: 56; LOCATION: R2L9; IP: GENERIC; FP_TECH: LPDB; DRAWING: @RVP1_ADL_SB_ADP_S_DDR5_SODIMM_2DPC_LIB.H55_DG2_2DPC(SCH_1):PAGE56; CDS_LIB: discrete; PCB Footprint: SMR0402IA; ROT: 2; CHIPS_PART_NAME: RES; CDS_PART_NAME: RES_0402-A93548-034,EMPTY,10K,1%,1/16W,LPDB,GENERIC; CDS_LOCATION: R2L9; ASI_MODEL: A93548-034
R2L12 = RES#1: PART_NUMBER: A93549-001; CHIPS_PART_NAME: RES; CDS_PHYS_PART_NAME: RES_0402-A93549-001,CHIP,0,5%,1/16W,LPDB,GENERIC; WATTAGE: 1/16W; OriginalSymbolOrigin: (-75,25); XY: (-6150,5850); VER: 1; ROT: 2; PHYS_PAGE: 56; LOCATION: R2L12; IP: GENERIC; FP_TECH: LPDB; DRAWING: @RVP1_ADL_SB_ADP_S_DDR5_SODIMM_2DPC_LIB.H55_DG2_2DPC(SCH_1):PAGE56; CDS_LIB: discrete; PCB Footprint: SMR0402IA; CDS_PART_NAME: RES_0402-A93549-001,CHIP,0,5%,1/16W,LPDB,GENERIC; CDS_LOCATION: R2L12
R2L13 = RES: CDS_PHYS_PART_NAME: RES_0402-A93548-517,EMPTY,4.7K,1%,1/16W,LPDB,GENERIC; WATTAGE: 1/16W; OriginalSymbolOrigin: (-25,75); XY: (-6400,6425); VER: 2; ROT: 0; PHYS_PAGE: 56; LOCATION: R2L13; IP: GENERIC; FP_TECH: LPDB; DRAWING: @RVP1_ADL_SB_ADP_S_DDR5_SODIMM_2DPC_LIB.H55_DG2_2DPC(SCH_1):PAGE56; CDS_LIB: discrete; PCB Footprint: SMR0402IA; CHIPS_PART_NAME: RES; CDS_PART_NAME: RES_0402-A93548-517,EMPTY,4.7K,1%,1/16W,LPDB,GENERIC; CDS_LOCATION: R2L13
R2L15 = C_RES: CDS_PHYS_PART_NAME: C_RES_0402-A93549-023,RES,10K,5%,0.0625W,TK2,GENERIC; CDS_LMAN_SYM_OUTLINE: -50,50,50,-50; FP_TECH: TK2; IP: GENERIC; ROOM: NONE; WATTAGE: 0.0625W; OriginalSymbolOrigin: (-25,75); XY: (-10475,3100); VER: 2; ROT: 0; PHYS_PAGE: 56; LOCATION: R2L15; DRAWING: @RVP1_ADL_SB_ADP_S_DDR5_SODIMM_2DPC_LIB.H55_DG2_2DPC(SCH_1):PAGE56; CDS_LIB: c_discrete; VARIANT: ?; PCB Footprint: CTK2_SM0402_1100X550_MA; CHIPS_PART_NAME: C_RES; CDS_PART_NAME: C_RES_0402-A93549-023,RES,10K,5%,0.0625W,TK2,GENERIC; CDS_LOCATION: R2L15
R2L18 = RES: CDS_PHYS_PART_NAME: RES_0402-G21497-014,EMPTY,10K,5%,1/16W,LPDB,GENERIC; WATTAGE: 1/16W; OriginalSymbolOrigin: (-25,75); XY: (-10475,2725); VER: 2; ROT: 0; ROOM: ROOM_PROP_TEST_73; PHYS_PAGE: 56; LOCATION: R2L18; IP: GENERIC; FP_TECH: LPDB; DRAWING: @RVP1_ADL_SB_ADP_S_DDR5_SODIMM_2DPC_LIB.H55_DG2_2DPC(SCH_1):PAGE56; CDS_LIB: discrete; PCB Footprint: SMR0402IA; CHIPS_PART_NAME: RES; CDS_PART_NAME: RES_0402-G21497-014,EMPTY,10K,5%,1/16W,LPDB,GENERIC; CDS_LOCATION: R2L18
R5601 = RES: CDS_PHYS_PART_NAME: RES_0402-A93548-517,EMPTY,4.7K,1%,1/16W,LPDB,GENERIC; WATTAGE: 1/16W; OriginalSymbolOrigin: (-25,75); XY: (-6925,6425); VER: 2; ROT: 0; PHYS_PAGE: 56; LOCATION: R5601; IP: GENERIC; FP_TECH: LPDB; DRAWING: @RVP1_ADL_SB_ADP_S_DDR5_SODIMM_2DPC_LIB.H55_DG2_2DPC(SCH_1):PAGE56; CDS_LIB: discrete; PCB Footprint: SMR0402IA; CHIPS_PART_NAME: RES; CDS_PART_NAME: RES_0402-A93548-517,EMPTY,4.7K,1%,1/16W,LPDB,GENERIC; CDS_LOCATION: R5601